# EAGLE design ESP32breakout_V2-send (EAGLE 7.7.0)
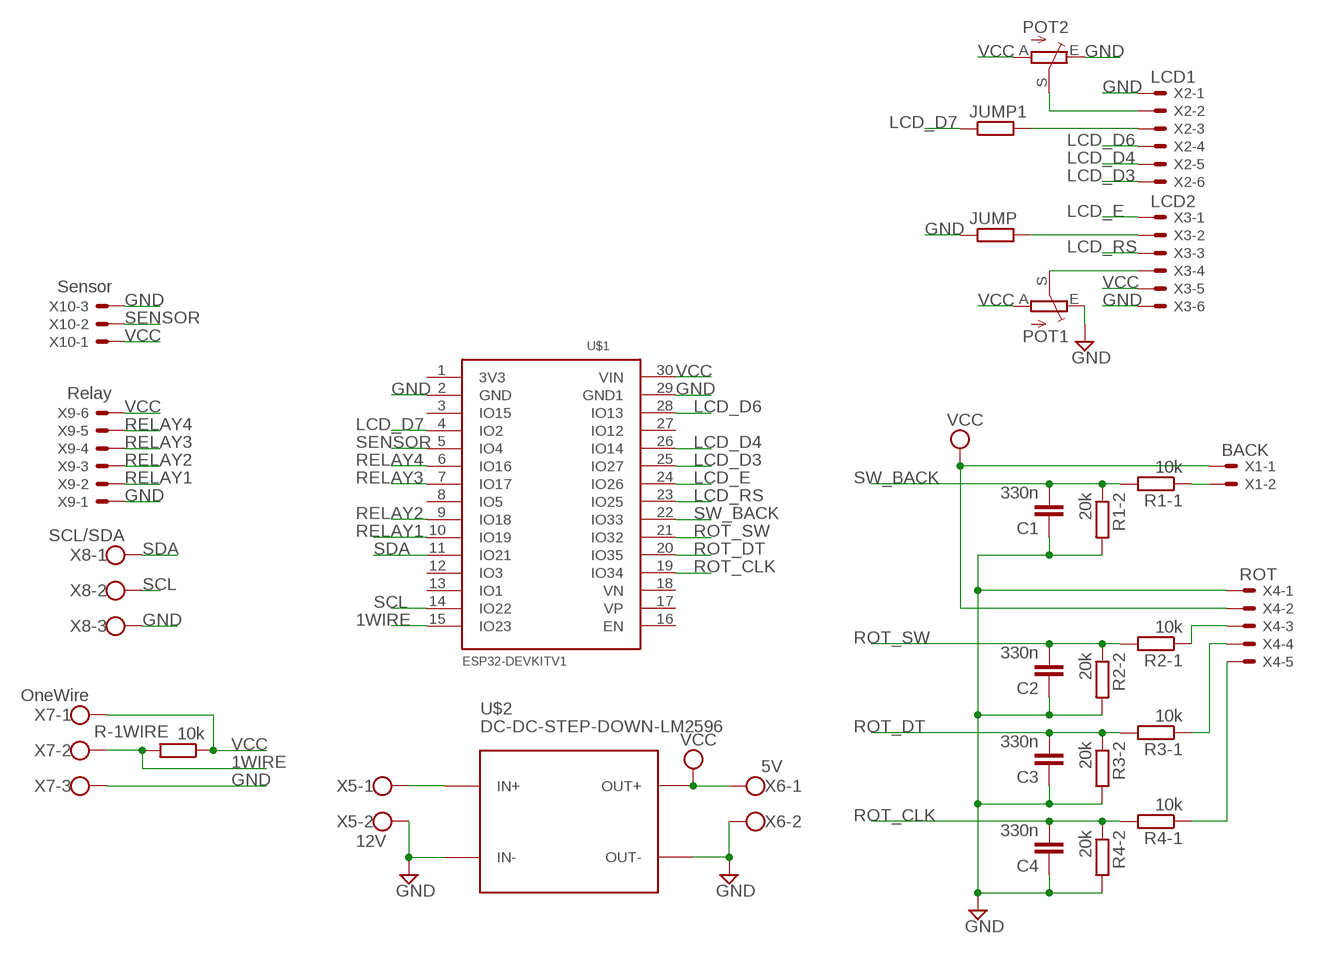
[diagram p0: schematic, sheet 1]

## Parts
C1  330n  C-EU025-024X044  [C025-024X044]
C2  330n  C-EU025-024X044  [C025-024X044]
C3  330n  C-EU025-024X044  [C025-024X044]
C4  330n  C-EU025-024X044  [C025-024X044]
JUMP  R-EU_0207/5V  [0207/5V]
JUMP1  R-EU_0207/5V  [0207/5V]
POT1  TRIM_EU-CA6V  [CA6V]
POT2  TRIM_EU-CA6V  [CA6V]
R1-1  10k  R-EU_0204/7  [0204/7]
R1-2  20k  R-EU_0204/7  [0204/7]
R2-1  10k  R-EU_0204/7  [0204/7]
R2-2  20k  R-EU_0204/7  [0204/7]
R3-1  10k  R-EU_0204/7  [0204/7]
R3-2  20k  R-EU_0204/7  [0204/7]
R4-1  10k  R-EU_0204/7  [0204/7]
R4-2  20k  R-EU_0204/7  [0204/7]
R-1WIRE  10k  R-EU_0204/7  [0204/7]
U$1  ESP32DEVKITV1  [ESP32-DEVKITV1]
U$2  DC-DC-STEP-DOWN-LM2596  [DC-DC-STEP-DOWN-LM2596]
X1  BACK  22-23-2021  [22-23-2021]
X2  LCD1  22-23-2061  [22-23-2061]
X3  LCD2  22-23-2061  [22-23-2061]
X4  ROT  22-23-2051  [22-23-2051]
X5  12V  W237-102  [W237-102]
X6  5V  W237-102  [W237-102]
X7  OneWire  W237-103  [W237-103]
X8  SCL/SDA  W237-103  [W237-103]
X9  Relay  22-23-2061  [22-23-2061]
X10  Sensor  22-23-2031  [22-23-2031]

## Nets
1WIRE: R-1WIRE.2 U$1.15(IO23) X7.2
GND: C1.1 C2.1 C3.1 C4.1 JUMP.1 POT1.E POT2.E R1-2.2 R2-2.2 R3-2.2 R4-2.2 U$1.2(GND) U$1.29(GND1) U$2.IN- U$2.OUT- X2.1 X3.6 X4.1 X5.2 X6.2 X7.3 X8.3 X9.1 X10.3
LCD_D3: U$1.25(IO27) X2.6
LCD_D4: U$1.26(IO14) X2.5
LCD_D6: U$1.28(IO13) X2.4
LCD_D7: JUMP1.1 U$1.4(IO2)
LCD_E: U$1.24(IO26) X3.1
LCD_RS: U$1.23(IO25) X3.3
N$1: R1-1.1 X1.2
N$2: JUMP.2 X3.2
N$3: U$2.IN+ X5.1
N$4: R2-1.1 X4.3
N$5: R3-1.1 X4.4
N$7: JUMP1.2 X2.3
N$8: POT2.S X2.2
N$9: R4-1.1 X4.5
POT_LCD1: POT1.S X3.4
RELAY1: U$1.10(IO19) X9.2
RELAY2: U$1.9(IO18) X9.3
RELAY3: U$1.7(IO17) X9.4
RELAY4: U$1.6(IO16) X9.5
ROT_CLK: C4.2 R4-1.2 R4-2.1 U$1.19(IO34)
ROT_DT: C3.2 R3-1.2 R3-2.1 U$1.20(IO35)
ROT_SW: C2.2 R2-1.2 R2-2.1 U$1.21(IO32)
SCL: U$1.14(IO22) X8.2
SDA: U$1.11(IO21) X8.1
SENSOR: U$1.5(IO4) X10.2
SW_BACK: C1.2 R1-1.2 R1-2.1 U$1.22(IO33)
VCC: POT1.A POT2.A R-1WIRE.1 U$1.30(VIN) U$2.OUT+ X1.1 X3.5 X4.2 X6.1 X7.1 X9.6 X10.1
Unconnected: U$1.1(3V3) U$1.3(IO15) U$1.8(IO5) U$1.12(IO3) U$1.13(IO1) U$1.16(EN) U$1.17(VP) U$1.18(VN) U$1.27(IO12)

## Library data of the parts
C1-C4 = rcl:C-EU: CAPACITOR, European symbol; SPICEPREFIX: C
JUMP JUMP1 R1-1 R1-2 R2-1 R2-2 R3-1 R3-2 R4-1 R4-2 R-1WIRE = rcl:R-EU_: RESISTOR, European symbol; SPICEPREFIX: R
POT1 POT2 = pot:TRIM_EU-: POTENTIOMETER
U$1 = ESP32-DEVKITV1:ESP32DEVKITV1
U$2 = diy-modules:DC-DC-STEP-DOWN-LM2596: DC/DC Step-Down Regulator based on LM2596-ADJ chip LM2596 datasheet available here: http://www.ti.com/lit/ds/symlink/lm2596.pdf Click here to find device on ebay.com <http://www.ebay.com/sch/lm2596+power+regulator>
X1 = con-molex:22-23-2021: .100" (2.54mm) Center Header - 2 Pin; MF: MOLEX; MPN: 22-23-2021; OC_FARNELL: 1462926; OC_NEWARK: 25C3832
X2 X3 X9 = con-molex@1:22-23-2061: .100" (2.54mm) Center Header - 6 Pin; MF: MOLEX; MPN: 22-23-2061; OC_FARNELL: 1462922; OC_NEWARK: 27C1933
X4 = con-molex@1:22-23-2051: .100" (2.54mm) Center Header - 5 Pin; MF: MOLEX; MPN: 22-23-2051; OC_FARNELL: 1462952; OC_NEWARK: 38C9178
X5 X6 = con-wago-500:W237-102: WAGO SCREW CLAMP; MPN: 237-102; OC_FARNELL: unknown; OC_NEWARK: 70K9898
X7 X8 = con-wago-500:W237-103: WAGO SCREW CLAMP; MPN: 237-103; OC_FARNELL: unknown; OC_NEWARK: 18M7116
X10 = con-molex@1:22-23-2031: .100" (2.54mm) Center Header - 3 Pin; MF: MOLEX; MPN: 22-23-2031; OC_FARNELL: 1462950; OC_NEWARK: 30C0862

## Board
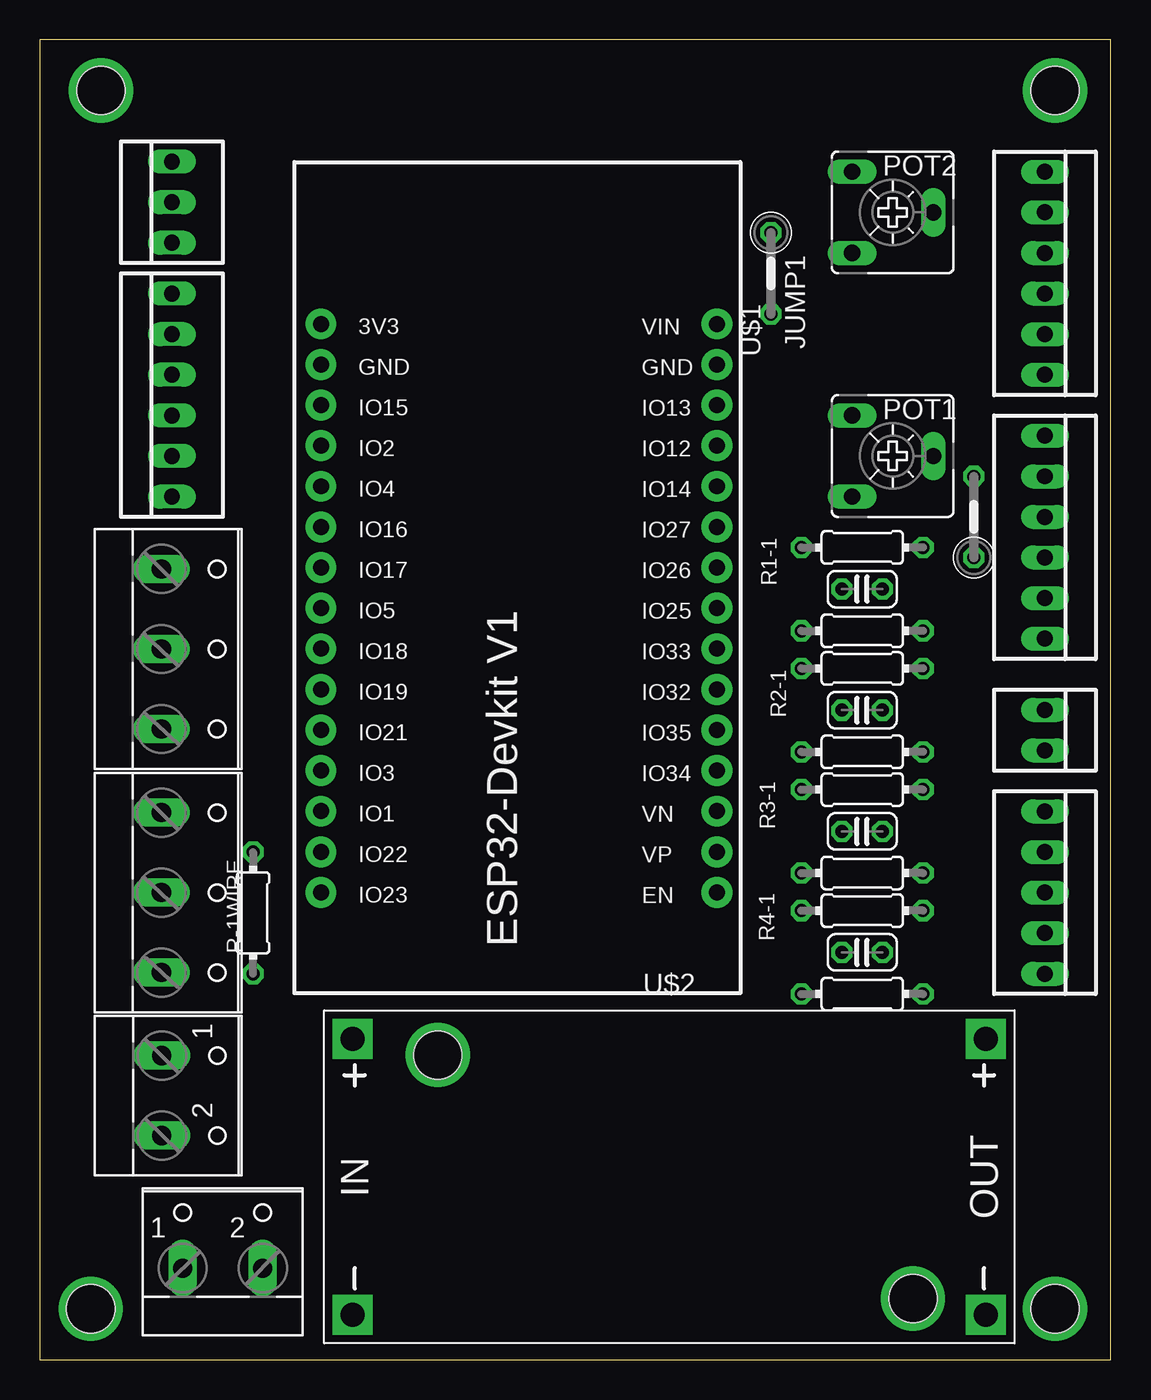
[diagram p1: board, top side]
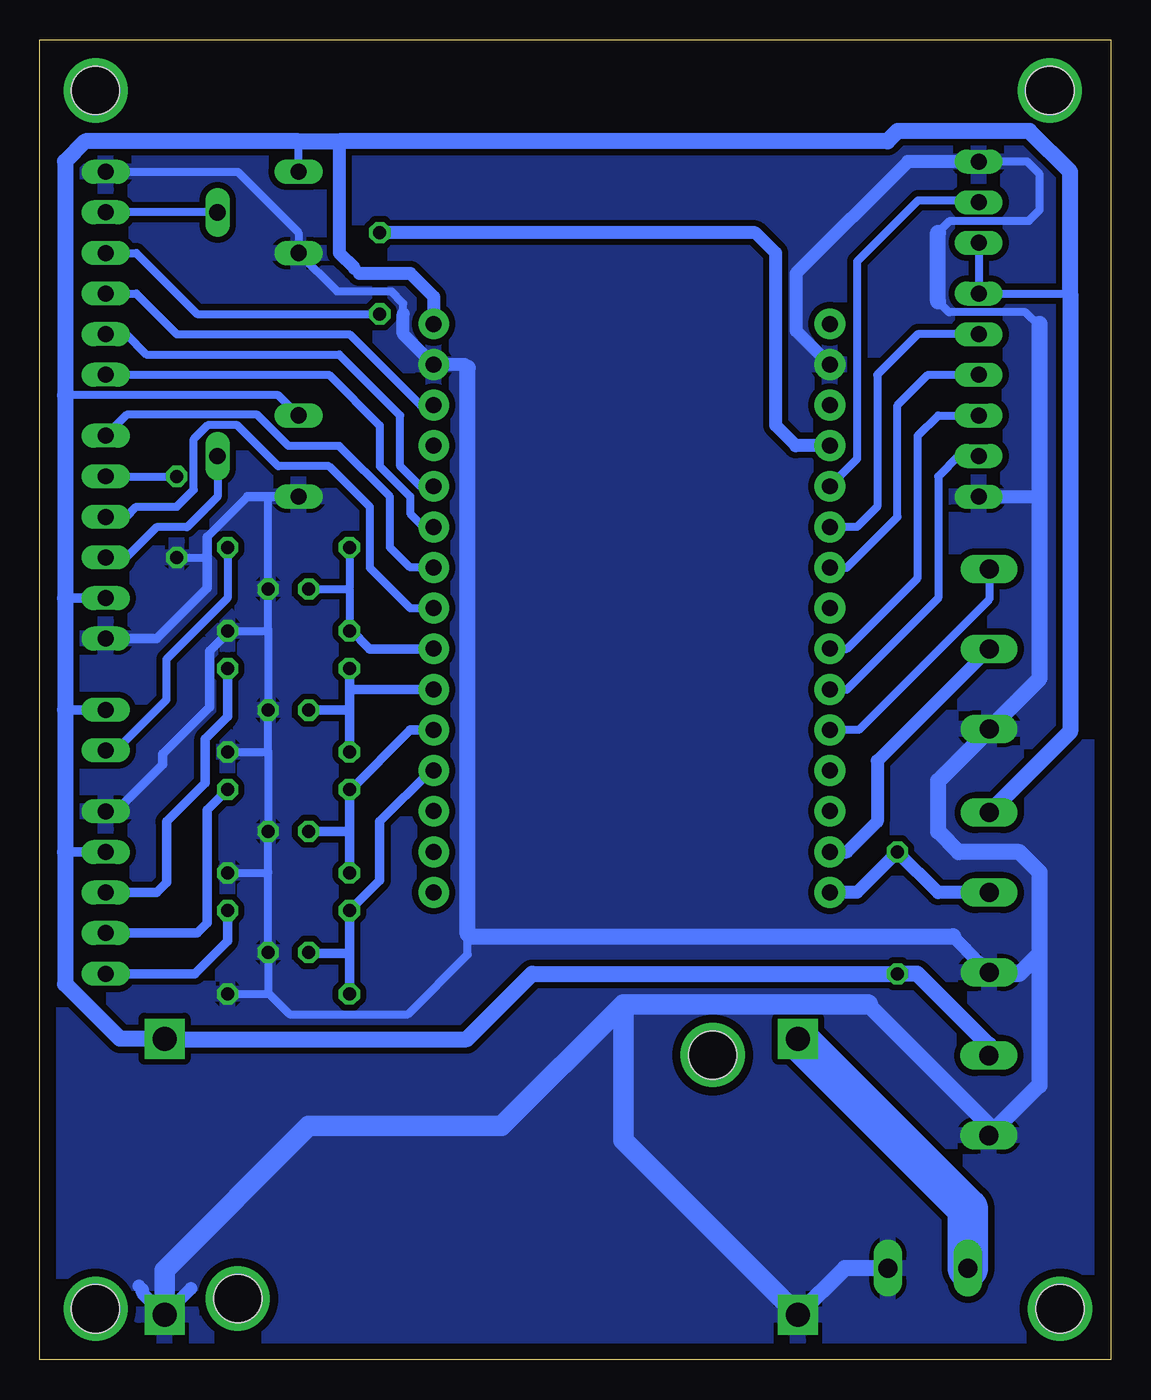
[diagram p2: board, bottom side, seen from below]

Size 66.98 x 82.54 mm. Coordinates in mm from the lower left corner, seen from the top.
Outline: 0,0 66.98,0 66.98,82.54 0,82.54 0,0
Copper layers (1*16): Top 0.035mm / dielectric 1.5mm / Bottom 0.035mm
Design rules "default *": minimum track width 6mil, minimum drill 0.35mm, track to track 15mil, track to pad 15mil, pad to pad 6mil, via to via 6mil, smd to smd 6mil, copper to edge 40mil, drill to drill 6mil, minimum pad ring 10mil, minimum via ring 8mil, stop-mask expansion 4mil, vias tented up to drill 0mil, thermal gap 10mil
Holes 3 mm at 3.17,3.18 63.5,3.18 63.5,79.38 3.81,79.38

### Footprints (pad centres in the part's own frame; a part is rotated, then mirrored left to right if it is on the bottom)
C025-024X044 = drill 0.813 octagon: 1 -1.27,0; 2 1.27,0
0207/5V = drill 0.813 octagon: 1 -2.54,0; 2 2.54,0
CA6V = drill 1.016 long: A -2.54,-2.54; E 2.54,-2.54; S 0,2.54
0204/7 = drill 0.813 octagon: 1 -3.81,0; 2 3.81,0
ESP32-DEVKITV1 = drill 1 pad 1.93: 1 -22.87,-13.54; 2 -20.33,-13.54; 3 -17.79,-13.54; 4 -15.25,-13.54; 5 -12.71,-13.54; 6 -10.17,-13.54; 7 -7.63,-13.54; 8 -5.09,-13.54; 9 -2.55,-13.54; 10 -0.01,-13.54; 11 2.53,-13.54; 12 5.07,-13.54; 13 7.61,-13.54; 14 10.15,-13.54; 15 12.69,-13.54; 16 12.69,11.23; 17 10.15,11.23; 18 7.61,11.23; 19 5.07,11.23; 20 2.53,11.23; 21 -0.01,11.23; 22 -2.55,11.23; 23 -5.09,11.23; 24 -7.63,11.23; 25 -10.17,11.23; 26 -12.71,11.23; 27 -15.25,11.23; 28 -17.79,11.23; 29 -20.33,11.23; 30 -22.87,11.23
DC-DC-STEP-DOWN-LM2596 = drill 1.5 pad 2.5 square: IN+ -19.812,8.636; IN- -19.812,-8.636; OUT+ 19.812,8.636; OUT- 19.812,-8.636 | hole 3: -14.478,7.62; 15.24,-7.62
22-23-2021 = drill 1 long: 1 -1.27,0; 2 1.27,0
22-23-2061 = drill 1 long: 1 -6.35,0; 2 -3.81,0; 3 -1.27,0; 4 1.27,0; 5 3.81,0; 6 6.35,0
22-23-2051 = drill 1 long: 1 -5.08,0; 2 -2.54,0; 3 0,0; 4 2.54,0; 5 5.08,0
W237-102 = drill 1.194 long: 1 -2.5,-1.27; 2 2.5,-1.27
W237-103 = drill 1.194 long: 1 -5,-1.29; 2 0,-1.29; 3 5,-1.29
22-23-2031 = drill 1 long: 1 -2.54,0; 2 0,0; 3 2.54,0

### Placement (x,y rotation side)
C1  51.43,48.19 180 top
C2  51.43,40.62 180 top
C3  51.43,33.04 180 top
C4  51.43,25.47 180 top
JUMP  58.42,52.7 90 top
JUMP1  45.72,67.95 270 top
POT1  53.34,56.51 270 top
POT2  53.34,71.76 270 top
R1-1  51.43,50.8 180 top
R1-2  51.43,45.58 0 top
R2-1  51.43,43.23 180 top
R2-2  51.43,38.01 0 top
R3-1  51.43,35.65 180 top
R3-2  51.43,30.43 0 top
R4-1  51.43,28.08 180 top
R4-2  51.43,22.86 0 top
R-1WIRE  13.33,27.94 90 top
U$1  31.12,41.91 270 top
U$2  39.37,11.43 0 top
X1  62.86,39.37 270 top
X2  62.86,67.95 270 top
X3  62.86,51.43 270 top
X4  62.86,29.21 270 top
X5  11.43,6.99 0 top
X6  8.89,16.51 270 top
X7  8.89,29.21 270 top
X8  8.89,44.45 270 top
X9  8.26,60.32 90 top
X10  8.26,72.39 90 top

### Tracks (layer width: path | path; a pad name or v marks a point on that pad's centre or on a via)
1WIRE
  Bottom 0.813: X7.2 10.79,29.21 R-1WIRE.2 15.88,29.22 U$1.15
GND
  Bottom 0.508: 52.71,32.97 C3.1 | 52.7,38.01 C3.1 | 52.7,22.93 C4.1 52.7,30.48 | 52.7,22.93 51.37,21.59 43.96,21.59 40.22,25.33 40.22,26.6 | 7.57,39.42 X8.3 | 10.8,66.19 10.12,65.52 5.33,65.52 4.45,64.62 4.45,64.77 | X2.1 54.61,74.3 50.8,70.48 POT2.E 48.4,66.81 45.02,66.81 44.25,66.05 44.25,65.41 | 52.7,53.97 C1.1 52.7,45.65 52.71,45.58 R1-2.2 52.7,45.58 C2.1 52.7,38.01 | R2-2.2 52.7,38.01 | 52.7,30.48 C3.1 | R3-2.2 52.75,30.43 52.7,30.48 | R4-2.2 52.77,22.86 52.7,22.93 | 53.98,53.97 56.52,51.43 | JUMP.1 56.52,50.16 | 10.8,70.48 10.05,71.23 5.12,71.23 4.44,71.91 4.44,74.14 5.22,74.93 X10.3 | 7.89,24.5 8.21,24.82
  Bottom 0.61: X4.1 62.23,34.29 59.31,37.21 59.31,37.87 56.36,40.82 56.36,44.32 55.24,45.44 R1-2.2 | POT1.E 52.7,53.97 53.98,53.97 | 56.52,51.43 56.52,50.16 56.52,48.26 59.69,45.08 X3.6
  Bottom 0.813: 9.86,26.47 8.21,24.82 | 7.89,24.5 X7.3 7.52,24.13 6.88,24.13 | X9.1 4.45,53.97 | X10.3 12.7,74.93 19.69,67.95 19.69,64.35 U$1.2 | 44.25,65.41 44.25,64.15 U$1.29 40.44,62.24 40.22,62.02 | 60.8,4.61 60.58,4.38 60.58,4.19 U$2.OUT- 57.53,4.44 57.53,4.45
  Bottom 1.016: X5.2 16.64,5.71 U$2.IN- | 40.22,62.02 40.22,26.6 40.09,26.47 9.86,26.47 | 6.88,24.13 5.71,24.13 4.45,25.4 | 4.45,25.4 4.45,30.48 5.71,31.75 9.53,31.75 10.79,33.02 10.79,36.2 7.57,39.42 | X8.3 4.45,42.6 4.45,53.97 4.45,64.77 | 10.8,66.19 10.8,70.48 | 15.2,22.23 7.62,14.64 X6.2 4.49,17.14 4.45,17.14 4.45,25.4
  Bottom 1.27: 19.14,3.22 U$2.IN- 30.48,13.72 30.48,22.23 | 30.48,22.23 38.1,14.61 50.16,14.61 59.18,5.59 U$2.OUT- | 30.48,22.23 15.2,22.23
  pour Bottom: -1.27,83.82 68.58,83.82 68.58,-1.91 -1.91,-1.91 -1.91,83.82
LCD_D3
  Bottom 0.508: X2.6 48.89,61.59 45.72,58.42 45.72,55.88 43.82,53.98 43.82,52.92 42.98,52.08 U$1.25
LCD_D4
  Bottom 0.508: U$1.26 43.19,54.62 44.45,55.88 44.45,59.05 48.26,62.87 60.32,62.87 61.59,64.14 X2.5
LCD_D6
  Bottom 0.508: X2.4 60.96,66.67 58.42,64.14 47.62,64.14 43.18,59.69 U$1.28
LCD_D7
  Bottom 0.813: U$1.4 19.7,57.16 20.96,58.42 20.96,69.22 22.23,70.48 JUMP1.1
LCD_E
  Bottom 0.508: U$1.24 43.82,49.54 45.09,50.8 45.09,53.97 48.26,57.15 51.43,57.15 53.39,59.11 61.54,59.11 X3.1
LCD_RS
  Bottom 0.508: U$1.23 43.82,47 46.35,49.53 46.35,53.34 48.89,55.88 52.07,55.88 54.63,58.45 56.49,58.45 57.35,57.58 57.35,54.41 58.42,53.34 60.96,53.34 61.59,52.7 X3.3
N$1
  Bottom 0.508: X1.2 62.23,38.1 59.05,41.27 59.05,43.81 55.24,47.62 R1-1.1
N$2
  Bottom 0.508: X3.2 JUMP.2
N$3
  Bottom 2.54: U$2.IN+ 8.93,9.44 X5.1
N$4
  Bottom 0.61: R2-1.1 55.24,40.22 56.64,38.83 56.64,36.07 59.05,33.65 59.05,29.84 59.69,29.21 X4.3
N$5
  Bottom 0.61: R3-1.1 56.52,34.38 56.52,27.3 57.15,26.67 X4.4
N$7
  Bottom 0.508: X2.3 60.96,69.22 57.15,65.41 JUMP1.2
N$8
  Bottom 0.508: POT2.S X2.2
N$9
  Bottom 0.61: R4-1.1 55.24,26.17 57.29,24.13 X4.5
N$28  (via drill 3)
  other vias: 3.81,79.38
N$29  (via drill 3)
  other vias: 63.5,79.38
N$30  (via drill 3)
  other vias: 24.89,19.05
N$31  (via drill 3)
  other vias: 54.61,3.81
N$32  (via drill 3)
  other vias: 63.5,3.18
N$33  (via drill 3)
  other vias: 3.17,3.18
POT_LCD1
  Bottom 0.508: X3.4 61.59,50.16 59.69,52.07 57.78,52.07 55.88,53.97 POT1.S
RELAY1
  Bottom 0.508: X9.2 9.53,56.51 10.79,55.24 10.79,47.62 16.51,41.91 U$1.10
RELAY2
  Bottom 0.508: U$1.9 16.51,44.45 12.06,48.89 12.06,57.78 10.79,59.05 X9.3
RELAY3
  Bottom 0.508: U$1.7 16.51,49.53 13.33,52.7 13.33,59.69 11.43,61.59 X9.4
RELAY4
  Bottom 0.508: X9.5 12.06,64.14 14.61,61.59 14.61,53.34 15.87,52.08 U$1.6
ROT_CLK
  Bottom 0.61: U$1.19 42.54,36.83 45.72,33.65 45.72,29.98 R4-1.2 47.62,25.4 | R4-2.1 47.62,25.4 | C4.2 50.1,25.4 47.62,25.4
ROT_DT
  Bottom 0.61: U$1.20 43.81,39.37 47.62,35.56 R3-1.2 47.62,33.02 | R3-2.1 47.62,33.02 | C3.2 50.14,33.02 47.62,33.02
ROT_SW
  Bottom 0.508: R2-1.2 47.62,43.2 | 50.13,40.62 C2.2
  Bottom 0.61: U$1.21 47.62,41.91 | 47.62,41.91 R2-1.2 | 47.62,41.91 47.62,40.64 | 47.62,40.64 R2-2.1 | C2.2 47.65,40.62 47.62,40.64
SCL
  Bottom 0.813: U$1.14 16.5,31.76 14.61,33.65 14.61,37.45 X8.2
SDA
  Bottom 0.508: X8.1 7.6,47.54 15.77,39.38 U$1.11
SENSOR
  Bottom 0.508: U$1.5 15.85,56.34 15.85,68.7 12.04,72.51 8.38,72.51 X10.2
SW_BACK
  Bottom 0.508: R1-1.2 47.62,48.26 47.69,48.19 C1.2 47.62,48.19 R1-2.1
  Bottom 0.61: U$1.22 46.35,44.45 47.56,45.65 R1-2.1
VCC
  Bottom 0.508: X10.1 X9.6 2.54,66.67 | POT2.A 50.8,76.2 | POT1.A 52.07,60.32 65.41,60.32 | 47.31,68.26 46.99,67.95
  Bottom 0.61: X4.2 65.41,31.75 | X1.1 65.41,40.64 | X3.5 65.41,47.62
  Bottom 0.813: 48.26,76.2 48.26,69.22 47.31,68.26 | 46.99,67.95 43.81,67.95 42.34,66.48 U$1.30
  Bottom 1.016: X7.1 2.54,39.27 2.54,66.67 2.54,74.3 5.08,76.84 13.33,76.84 13.97,76.2 48.26,76.2 50.8,76.2 64.14,76.2 65.41,74.93 65.41,60.32 65.41,47.62 65.41,40.64 65.41,31.75 65.41,23.5 61.98,20.07 U$2.OUT+ 59.16,20.04 40.28,20.04 36.2,24.13 R-1WIRE.1 12.11,24.13 7.66,19.68 7.62,19.68 X6.1

### Text on the board
Reference: ESP32 BREAKBOARD | KRISNA DIASTAMA | IO-LCD-BUTTONS | TF ITB
tDocu: GND | K | S | A | 5V | D7 | 5V | D6 | R4 | D4 | R3 | D3 | R2 | E | R1 | RW | RS | GND | V0 | SDA | VDD | VSS | SCL | 5V | GND | SW | 5V | GND | 5V | SW | 1Wire | DT | CLK | GND | 5V | GND | 12V | GND